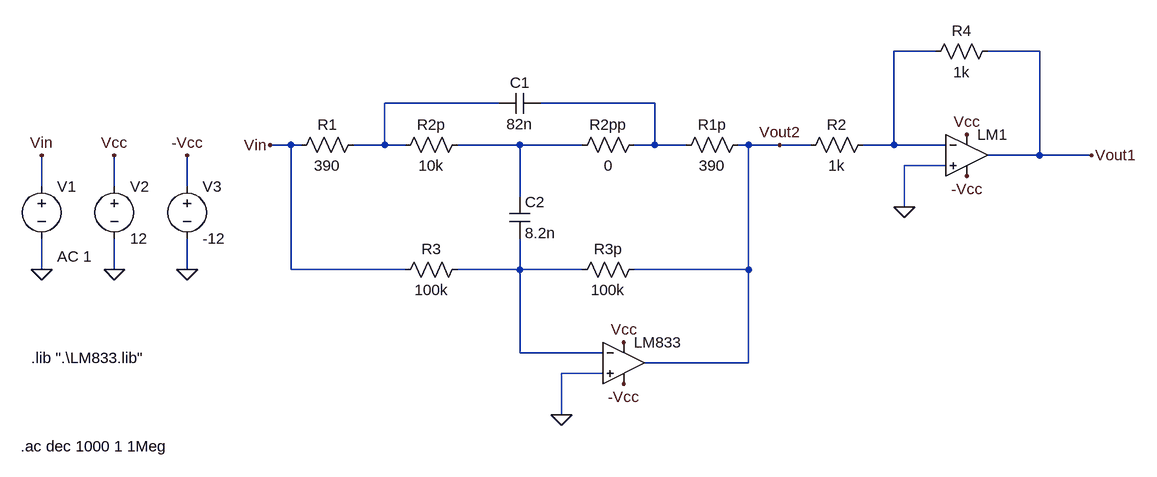
[diagram p0: schematic Unica instancia.asc]
Unica instancia.asc, the LTspice schematic file:
Version 4
SHEET 1 1372 680
WIRE 896 -80 832 -80
WIRE 1056 -80 976 -80
WIRE 224 0 48 0
WIRE 464 0 288 0
WIRE -96 64 -128 64
WIRE -80 64 -96 64
WIRE 48 64 48 0
WIRE 48 64 0 64
WIRE 80 64 48 64
WIRE 256 64 160 64
WIRE 352 64 256 64
WIRE 464 64 464 0
WIRE 464 64 432 64
WIRE 512 64 464 64
WIRE 608 64 592 64
WIRE 656 64 608 64
WIRE 704 64 656 64
WIRE 832 64 832 -80
WIRE 832 64 784 64
WIRE 912 64 832 64
WIRE 1056 80 1056 -80
WIRE 1056 80 976 80
WIRE 1136 80 1056 80
WIRE 912 96 848 96
WIRE -480 128 -480 80
WIRE -368 128 -368 80
WIRE -256 128 -256 80
WIRE 256 144 256 64
WIRE 848 160 848 96
WIRE -480 256 -480 208
WIRE -368 256 -368 208
WIRE -256 256 -256 208
WIRE -96 256 -96 64
WIRE 80 256 -96 256
WIRE 256 256 256 208
WIRE 256 256 160 256
WIRE 352 256 256 256
WIRE 608 256 608 64
WIRE 608 256 432 256
WIRE 256 384 256 256
WIRE 384 384 256 384
WIRE 608 400 608 256
WIRE 608 400 448 400
WIRE 384 416 320 416
WIRE 320 480 320 416
FLAG -480 256 0
FLAG -368 256 0
FLAG -256 256 0
FLAG 320 480 0
FLAG -480 80 Vin
FLAG -128 64 Vin
FLAG 1136 80 Vout1
FLAG -368 80 Vcc
FLAG 416 368 Vcc
FLAG -256 80 -Vcc
FLAG 416 432 -Vcc
FLAG 848 160 0
FLAG 944 48 Vcc
FLAG 944 112 -Vcc
FLAG 656 64 Vout2
SYMBOL res 176 48 R90
WINDOW 0 0 56 VBottom 2
WINDOW 3 32 56 VTop 2
SYMATTR InstName R2p
SYMATTR Value 10k
SYMBOL res 448 48 R90
WINDOW 0 0 56 VBottom 2
WINDOW 3 32 56 VTop 2
SYMATTR InstName R2pp
SYMATTR Value 0
SYMBOL res 176 240 R90
WINDOW 0 0 56 VBottom 2
WINDOW 3 32 56 VTop 2
SYMATTR InstName R3
SYMATTR Value 100k
SYMBOL res 448 240 R90
WINDOW 0 0 56 VBottom 2
WINDOW 3 32 56 VTop 2
SYMATTR InstName R3p
SYMATTR Value 100k
SYMBOL cap 240 144 R0
SYMATTR InstName C2
SYMATTR Value 8.2n
SYMBOL cap 288 -16 R90
WINDOW 0 0 32 VBottom 2
WINDOW 3 32 32 VTop 2
SYMATTR InstName C1
SYMATTR Value 82n
SYMBOL res 16 48 R90
WINDOW 0 0 56 VBottom 2
WINDOW 3 32 56 VTop 2
SYMATTR InstName R1
SYMATTR Value 390
SYMBOL res 608 48 R90
WINDOW 0 0 56 VBottom 2
WINDOW 3 32 56 VTop 2
SYMATTR InstName R1p
SYMATTR Value 390
SYMBOL voltage -480 112 R0
WINDOW 123 24 124 Left 2
WINDOW 39 0 0 Left 0
SYMATTR Value2 AC 1
SYMATTR InstName V1
SYMATTR Value ""
SYMBOL voltage -368 112 R0
SYMATTR InstName V2
SYMATTR Value 12
SYMBOL voltage -256 112 R0
SYMATTR InstName V3
SYMATTR Value -12
SYMBOL Opamps\\UniversalOpamp2 416 400 R0
SYMATTR InstName LM833
SYMBOL Opamps\\UniversalOpamp2 944 80 R0
SYMATTR InstName LM1
SYMBOL res 800 48 R90
WINDOW 0 0 56 VBottom 2
WINDOW 3 32 56 VTop 2
SYMATTR InstName R2
SYMATTR Value 1k
SYMBOL res 992 -96 R90
WINDOW 0 0 56 VBottom 2
WINDOW 3 32 56 VTop 2
SYMATTR InstName R4
SYMATTR Value 1k
TEXT -496 392 Left 2 !.lib ".\\LM833.lib"
TEXT -512 528 Left 2 !.ac dec 1000 1 1Meg

The netlist it stands for:
* Unica instancia.asc
R2p N004 N002 10k
R2pp N003 N004 0
R3 N005 Vin 100k
R3p Vout2 N005 100k
C2 N004 N005 8.2n
C1 N003 N002 82n
R1 N002 Vin 390
R1p Vout2 N003 390
V1 Vin 0 AC 1
V2 Vcc 0 12
V3 -Vcc 0 -12
XLM833 0 N005 Vcc -Vcc Vout2 level.2 Avol=1Meg GBW=10Meg Slew=10Meg ilimit=25m rail=0 Vos=0 phimargin=45 en=0 enk=0 in=0 ink=0 Rin=500Meg  ; pins IN+ IN- V+ V- OUT
XLM1 0 N001 Vcc -Vcc Vout1 level.2 Avol=1Meg GBW=10Meg Slew=10Meg ilimit=25m rail=0 Vos=0 phimargin=45 en=0 enk=0 in=0 ink=0 Rin=500Meg  ; pins IN+ IN- V+ V- OUT
R2 N001 Vout2 1k
R4 Vout1 N001 1k
.lib ".\LM833.lib"
.ac dec 1000 1 1Meg
.lib UniversalOpamps2.sub
.backanno
.end